# Altium schematic sheet HV_DRV_PA15FLA.SchDoc: PA15FLA
size 420 x 297 mm; CheckedBy: G. Kasprowicz; Author: Jakub Kajzer; CompanyName: WUT ISE; DrawnBy: Jakub Kajzer; Organization: WUT ISE; Address1: PW ISE; Address2: Nowowiejska 15/19 00-665 Warsaw; Address3: gkasprow@gmail.com; DocumentNumber: 3; Revision: 2; SheetNumber: 3; SheetTotal: 7; ModifiedBy: -; CreateDate: 03.08.2020; CheckedDate: -; Title2: High Voltage Amplifier; DivGrp: WUT ISE; Designer: Jakub Kajzer; ModifiedDate: -; ProjectName: Sensor Box
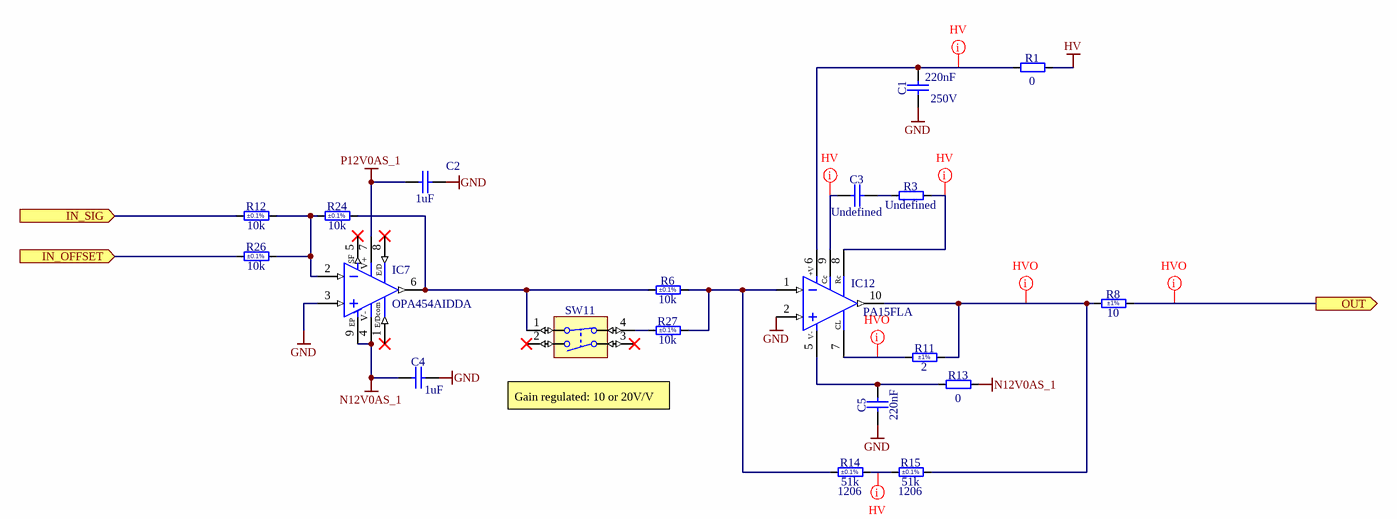
[diagram p0: HV_DRV_PA15FLA.SchDoc]

## Parts
C1  220nF  Voltage: 250V  [CAPC4532X165N]
C2  1uF  [CAPC1608X87N]
C3  Undefined  [CAPC3216X140N]
C4  1uF  [CAPC1608X87N]
C5  220nF  [CAPC1608X87N]
IC7  OPA454AIDDA  [SOIC127P600X170-9N-R249X300]
IC12  PA15FLA  [APEX_PA15FL_v]
R1  0  [RESC1608X55N]
R3  Undefined  [RESC3216X65N]
R6  10k  Tolerance: ±0.1%  [RESC1608X64N]
R8  10  Tolerance: ±1%  [RESC3216X65N]
R11  2  Tolerance: ±1%  [RESC1608X55N]
R12  10k  Tolerance: ±0.1%  [RESC1608X55N]
R13  0  [RESC1608X55N]
R14  51k  Tolerance: ±0.1%  Case: 1206  [RESC3216X65N]
R15  51k  Tolerance: ±0.1%  Case: 1206  [RESC3216X65N]
R24  10k  Tolerance: ±0.1%  [RESC1608X55N]
R26  10k  Tolerance: ±0.1%  [RESC1608X55N]
R27  10k  Tolerance: ±0.1%  [RESC1608X64N]
SW11  Switch  [SW_CTS_204-121ST]  (value not drawn)

## Ports
IN_OFFSET (in), IN_SIG (in), OUT (out)

## Nets
GND: C1.1 C2.2 C4.2 C5.1 IC7.3(IN+) IC12.2(IN+)
HV: R1.2
N12V0AS_1: C4.1 IC7.4(V-) IC7.9(Exposed_Pad) R13.2
P12V0AS_1: C2.1 IC7.7(V+)
IN_OFFSET: R26.1 ; port IN_OFFSET
IN_SIG: R12.1 ; port IN_SIG
OUT: R8.2 ; port OUT
NetC1_2: C1.2 IC12.6(+Vs) R1.1
NetC3_1: C3.1 IC12.9(Cc)
NetC3_2: C3.2 R3.1
NetC5_2: C5.2 IC12.5(-Vs) R13.1
NetIC7_2: IC7.2(IN-) R12.2 R24.1 R26.2
NetIC7_6: IC7.6(OUT) R6.1 R24.2 SW11.1
NetIC12_1: IC12.1(IN-) R6.2 R14.1 R27.2
NetIC12_7: IC12.7(CL) R11.1
NetIC12_8: IC12.8(Cc2) R3.2
NetIC12_10: IC12.10(OUT) R8.1 R11.2 R15.2
NetR14_2: R14.2 R15.1
NetR27_1: R27.1 SW11.4

Not connected (* = marked no-connect by the designer): IC7 1(E/Dcommon)* 5(Status_Flag)* 8(E/B)*; SW11 2* 3*

## Layout directives
net class HVO: NetIC12_7, NetIC12_10, OUT
net class HV: NetC1_2, NetC3_1, NetIC12_8, NetR14_2

## Notes on the sheet
- Gain regulated: 10 or 20V/V
- Project/Equipment
- Document
- Designer
- Drawn by
- Check.by
- Copyright WUT ISE 2018.
  This documentation describes Open Hardware and is licensed under the CERN OHL v.1.1. You may redistribute and modify this documentation under the terms of the CERN OHL v.1.1. (http://ohwr.org/CERNOHL). This documentation is distributed WITHOUT ANY EXPRESS OR IMPLIED WARRANTY, INCLUDING OF MERCHANTABILITY, SATISFACTORY QUALITY AND FITNESS FOR A PARTICULAR PURPOSE. Please see the CERN OHL v.1.1 for applicable conditions.
- Contact
- File
- Last Mod.
- Print Date
- Sheet
- Size
- A3
- of
- Rev
- (in symbol OPA454AIDDA) SF; E/D; E/Dcom; EP
- (in symbol PA15FLA_v) +V; Rc; V-

## Library data of the parts
C1 = CC1812_220NF_250V_10%_X7R_FT-CAP: Non-polarised capacitor; Part Description: Flexible Termination System (FT-CAP) SMD Multilayer Ceramic  Chip Capacitor; Manufacturer: KEMET; Manufacturer Part Number: C1812X224KARACTU; TC: X7R; Tolerance: ±10%; Part Number: CC1812_220NF_250V_10%_X7R_FT-CAP; Component Kind: Standard; Component Type: Standard; Pin Count: 2; Value: 220nF; Status: None; Case: 1812; Mounted: Yes; Socket: No; SMD: Yes; Sense: No; ComponentHeight: 1.65mm; HelpURL: \\cern.ch\dfs\Applications\Altium\Datasheets\CC1812_X7R_KEMET_FT-CAP.pdf; Author: CERN DEM JLC; CreateDate: 09.08.2018; LatestRevisionDate: 09.08.2018
C2 C4 = CC0603_1UF_50V_10%_X5R: Non-polarised capacitor; Part Description: SMD Multilayer Chip Ceramic Capacitor; Manufacturer: GENERIC; Manufacturer1 Part Number: C1608X5R1H105K080; Voltage: 50V; TC: X5R; Tolerance: ±10%; Part Number: CC0603_1UF_50V_10%_X5R; Component Kind: Standard; Component Type: Standard; Pin Count: 2; Value: 1uF; Status: None; Manufacturer Part Number: CC0603_1UF_50V_10%_X5R; Case: 0603; Mounted: Yes; Socket: No; SMD: Yes; Sense: No; Manufacturer1 Example: TDK; Manufacturer1 ComponentHeight: 0.9mm; HelpURL: \\cern.ch\dfs\Applications\Altium\Datasheets\CC0603_X5R_TDK_C.pdf; Author: CERN DEM JMW; CreateDate: 09.11.2015; LatestRevisionDate: 09.11.2015
C3 = CC1206_NO-VALUE: Non-polarised capacitor; Part Description: Reserved Footprint For a 1206 (3216) Chip Ceramic Capacitor; Mounted: No; Part Number: CC1206_NO-VALUE; Component Kind: Standard; Component Type: Standard; Pin Count: 2; Value: Undefined; Status: None; Manufacturer: Undefined; Manufacturer Part Number: CC1206_NO-VALUE; Case: 1206; Socket: No; SMD: Yes; Sense: No; Manufacturer1 ComponentHeight: 1.4mm; HelpURL: Undefined; Author: CERN DEM JLC; CreateDate: 05.05.2008; LatestRevisionDate: 16.11.2009
C5 = CC0603_220NF_25V_10%_X7R: Non-polarised capacitor; Part Description: SMD Multilayer Chip Ceramic Capacitor; Manufacturer: GENERIC; Manufacturer1 Part Number: C0603C224K3RACTU; Voltage: 25V; TC: X7R; Tolerance: ±10%; Part Number: CC0603_220NF_25V_10%_X7R; Component Kind: Standard; Component Type: Standard; Pin Count: 2; Value: 220nF; Status: Preferred; Manufacturer Part Number: CC0603_220NF_25V_10%_X7R; Case: 0603; Mounted: Yes; Socket: No; SMD: Yes; Sense: No; Manufacturer1 Example: KEMET; Manufacturer1 ComponentHeight: 0.87mm; HelpURL: \\cern.ch\dfs\Applications\Altium\Datasheets\CC0603_X7R_KEMET.pdf; Author: CERN DEM JLC; CreateDate: 29.10.2014; LatestRevisionDate: 29.10.2014
IC7 = OPA454AIDDA: High-Voltage (100V), High-Current (50mA) Operational Amplifier, G=1 Stable; Manufacturer: TEXAS INSTRUMENTS; PressFit: No; Bonding: No; Part Number: OPA454AIDDA; Component Kind: Standard; Component Type: Standard; Device: OPA454AIDDA; PackageDescription: SOIC, 1.27mm Pitch; 8 Pin, 4.00mm W X 5.00mm L X 1.70mm H body (w/Thermal Tab 2.49 X 3.00mm), IPC Medium Density; Part Description: High-Voltage (100V), High-Current (50mA) Operational Amplifier, G=1 Stable; Manufacturer Part Number: OPA454AIDDA; Pin Count: 9; Case: SOIC8; Mounted: Yes; Socket: No; SMD: Yes; Sense: No; ComponentHeight: 1.70mm; Author: CERN DEM JLC; HelpURL: \\cern.ch\dfs\Applications\Altium\Datasheets\OPA454AIDDA.pdf; CreateDate: 23.05.2011; LatestRevisionDate: 23.05.2011
IC12 = PA15FLA_v: High Voltage Power Operational Amplifier; Part Description: 200mA 450V High Voltage Power Operational Amplifier (FL Case Style); Manufacturer: APEX MICROTECHNOLOGY; PressFit: No; Bonding: No; Part Number: PA15FLA_v; Component Kind: Standard; Component Type: Standard; Device: PA15FLA; PackageDescription: Power 10 Pin SIP, DP Package Style, Pitch 2.54mm, Straight Leads For Vertical Mount; Manufacturer Part Number: PA15FLA; Pin Count: 10; Mounted: Yes; Socket: No; SMD: No; Sense: No; ComponentHeight: 23.14mm; Author: CERN DEM BC; HelpURL: \\cern.ch\dfs\Applications\Altium\Datasheets\PA15FLA.pdf; CreateDate: 08.06.2021; LatestRevisionDate: 08.06.2021
R1 R13 = R0603_0R_JUMPER: Resistor; Part Description: 1A (0.05R Max DC Resistance) Zero Ohm Jumper; Manufacturer: GENERIC; Manufacturer1 Part Number: NRC06Z0; PressFit: No; Part Number: R0603_0R_JUMPER; Component Kind: Standard; Component Type: Standard; Pin Count: 2; Value: 0; Status: Preferred; Manufacturer Part Number: R0603_0R_JUMPER; Case: 0603; Mounted: Yes; Sense: No; Socket: No; SMD: Yes; Manufacturer1 Example: NIC COMPONENT; Manufacturer1 ComponentHeight: 0.55mm; HelpURL: \\cern.ch\dfs\Applications\Altium\Datasheets\R0603_NIC_NRC.pdf; Author: CERN DEM JLC; CreateDate: 03.12.2007; LatestRevisionDate: 13.03.2008
R3 = R1206_NO-VALUE: Resistor; Part Description: Reserved Footprint For a 1206 (3216) Chip Resistor; PressFit: No; Mounted: No; Part Number: R1206_NO-VALUE; Component Kind: Standard; Component Type: Standard; Pin Count: 2; Value: Undefined; Status: None; Manufacturer: Undefined; Manufacturer Part Number: R1206_NO-VALUE; Case: 1206; Sense: No; Socket: No; SMD: Yes; Manufacturer1 Example: Undefined; Manufacturer1 Part Number: Undefined; Manufacturer1 ComponentHeight: Undefined; HelpURL: Undefined; Author: CERN DEM JLC; CreateDate: 03.12.2007; LatestRevisionDate: 13.03.2008
R6 R27 = R0603_10K_0.1%_0.1W_25PPM: Resistor - 0.1%; Part Description: Thin Film Chip Resistor; Manufacturer: GENERIC; Manufacturer1 Part Number: ERA3AEB103V; Power: 0.1W; TC: ±25ppm/°C; PressFit: No; Part Number: R0603_10K_0.1%_0.1W_25PPM; Component Kind: Standard; Component Type: Standard; Pin Count: 2; Value: 10k; Status: Not Recommended; Manufacturer Part Number: R0603_10K_0.1%_0.1W_25PPM; Case: 0603; Mounted: Yes; Sense: No; Socket: No; SMD: Yes; Manufacturer1 Example: PANASONIC; Manufacturer1 ComponentHeight: 0.55mm; HelpURL: \\cern.ch\dfs\Applications\Altium\Datasheets\R0603_PANASONIC_ERA.pdf; Author: CERN DEM JMW; CreateDate: 09.11.2015; LatestRevisionDate: 11.01.2017
R8 = R1206_10R_1%_0.25W_200PPM: Resistor - 1%; Part Description: General Purpose Thick Film Chip Resistor; Manufacturer: GENERIC; Manufacturer1 Part Number: NRC12F10R0TRF; Power: 0.25W; TC: ±200ppm/°C; PressFit: No; Part Number: R1206_10R_1%_0.25W_200PPM; Component Kind: Standard; Component Type: Standard; Pin Count: 2; Value: 10; Status: Preferred; Manufacturer Part Number: R1206_10R_1%_0.25W_200PPM; Case: 1206; Mounted: Yes; Sense: No; Socket: No; SMD: Yes; Manufacturer1 Example: NIC COMPONENT; Manufacturer1 ComponentHeight: 0.65mm; HelpURL: \\cern.ch\dfs\Applications\Altium\Datasheets\R1206_NIC_NRC.pdf; Author: CERN DEM JLC; CreateDate: 24.06.2009; LatestRevisionDate: 24.06.2009
R11 = R0603_2R_1%_0.1W_200PPM: Resistor - 1%; Part Description: General Purpose Thick Film Chip Resistor; Manufacturer: GENERIC; Manufacturer1 Part Number: 232270462008L or RC0603FR-072RL; Power: 0.1W; TC: ±200ppm/°C; PressFit: No; Part Number: R0603_2R_1%_0.1W_200PPM; Component Kind: Standard; Component Type: Standard; Pin Count: 2; Value: 2; Status: Preferred; Manufacturer Part Number: R0603_2R_1%_0.1W_200PPM; Case: 0603; Mounted: Yes; Sense: No; Socket: No; SMD: Yes; Manufacturer1 Example: YAGEO PHYCOMP; Manufacturer1 ComponentHeight: 0.65mm; HelpURL: \\cern.ch\dfs\Applications\Altium\Datasheets\R0603_Tyco_RN73.pdf; Author: CERN DEM JLC; CreateDate: 03.12.2007; LatestRevisionDate: 17.10.2012
R12 R24 R26 = R0603_10K_0.1%_0.063W_10PPM: Resistor - 0.1%; Part Description: Thin Film Chip Resistor; Manufacturer: GENERIC; Manufacturer1 Part Number: RN73C1J10KBTDF; Power: 0.063W; TC: ±10ppm; PressFit: No; Part Number: R0603_10K_0.1%_0.063W_10PPM; Component Kind: Standard; Component Type: Standard; Pin Count: 2; Value: 10k; Status: Not Recommended; Manufacturer Part Number: R0603_10K_0.1%_0.063W_10PPM; Case: 0603; Mounted: Yes; Sense: No; Socket: No; SMD: Yes; Manufacturer1 Example: TYCO HOLSWORTHY; Manufacturer1 ComponentHeight: 0.5mm; HelpURL: \\cern.ch\dfs\Applications\Altium\Datasheets\R0603_Tyco_RN73.pdf; Author: CERN DEM JLC; CreateDate: 03.12.2007; LatestRevisionDate: 13.03.2008
R14 R15 = R1206_51K_0.1%_0.25W_25PPM: Resistor - 0.1%; Part Description: Thin Film Chip Resistor; Manufacturer: GENERIC; Manufacturer1 Part Number: RN73H2BTTD5102B25; Power: 0.25W; TC: ±25ppm/°C; PressFit: No; Part Number: R1206_51K_0.1%_0.25W_25PPM; Component Kind: Standard; Component Type: Standard; Pin Count: 2; Value: 51k; Status: Not Recommended; Manufacturer Part Number: R1206_51K_0.1%_0.25W_25PPM; Mounted: Yes; Sense: No; Socket: No; SMD: Yes; Manufacturer1 Example: KOA; Manufacturer1 ComponentHeight: 0.70mm; HelpURL: \\cern.ch\dfs\Applications\Altium\Datasheets\R1206_KOA_RN73H.pdf; Author: CERN DEM JLC; CreateDate: 03.12.2007; LatestRevisionDate: 13.03.2008
SW11 = SW_CTS_204-121ST: 2x SPST DIP Switch 1NO + 1NF; Part Description: Single SPDT DIP Switch, (1NO + 1NF Coupled), CTS 204 Series; Manufacturer: CTS; PressFit: No; Part Number: SW_CTS_204-121ST; Component Kind: Standard; Component Type: Standard; Pin Count: 4; PackageDescription: Body 7.26 x 9.78mm, 2x SPST DIP, 1NO + 1NF Switch, CTS 204 Series; Family: Switch; Mounted: Yes; Socket: No; SMD: Yes; Sense: No; Status: None; Manufacturer Part Number: 204-121ST; ComponentHeight: 10.36mm; HelpURL: \\cern.ch\dfs\Applications\Altium\Datasheets\SW_CTS_204-121ST.pdf; Author: CERN DEM JLC; CreateDate: 28.08.2014; LatestRevisionDate: 28.08.2014